# EAGLE schematic Servo (EAGLE 9.6.2)
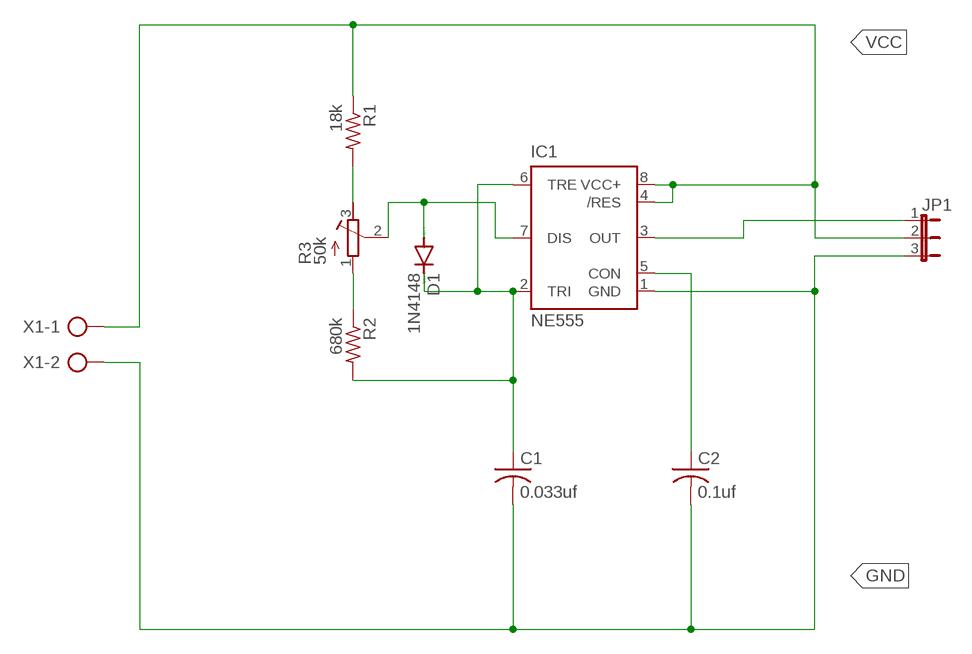
[diagram p0: schematic, sheet 1]

## Parts
C1  0.033uf  C-US025-024X044  [C025-024X044]
C2  0.1uf  C-US025-024X044  [C025-024X044]
D1  1N4148  1N4148DO35-10  [DO35-10]
IC1  NE555  [DIL-08]
JP1  JP2W  [JP2W]
R1  18k  R-US_0204/7  [0204/7]
R2  680k  R-US_0204/7  [0204/7]
R3  50k  R-TRIMM64W  [RTRIM64W]
X1  AK500/2  [AK500/2]

## Nets
GND: C1.2 C2.2 IC1.1(GND) JP1.3 X1.2
N$1: R2.1 R3.1(A)
N$2: IC1.3(OUT) JP1.1
N$3: C2.1 IC1.5(CON)
N$4: C1.1 D1.C IC1.2(TRI) IC1.6(TRE) R2.2
N$5: D1.A IC1.7(DIS) R3.2(S)
N$6: R1.2 R3.3(E)
VCC: IC1.4(/RES) IC1.8(VCC+) JP1.2 R1.1 X1.1

## Library data of the parts
C1 C2 = rcl:C-US: CAPACITOR, American symbol; SPICEPREFIX: C
D1 = diode:1N4148: DIODE high speed (Philips)
IC1 = st-microelectronics:NE555: General purpose bipolar Timer; MF: Arrow Electronics; MPN: NE555N; OC_FARNELL: 1467742; OC_NEWARK: 89K1486
JP1 = jumper:JP2W: JUMPER
R1 R2 = rcl:R-US_: RESISTOR, American symbol; SPICEPREFIX: R
R3 = rcl:R-TRIMM: Trimm resistor; SPICEMODEL: X; SPICEPREFIXL: POT
X1 = con-ptr500:AK500/2: CONNECTOR; OC_FARNELL: unknown; OC_NEWARK: unknown